# EAGLE design Teensy3Custom (EAGLE 6.5.0)
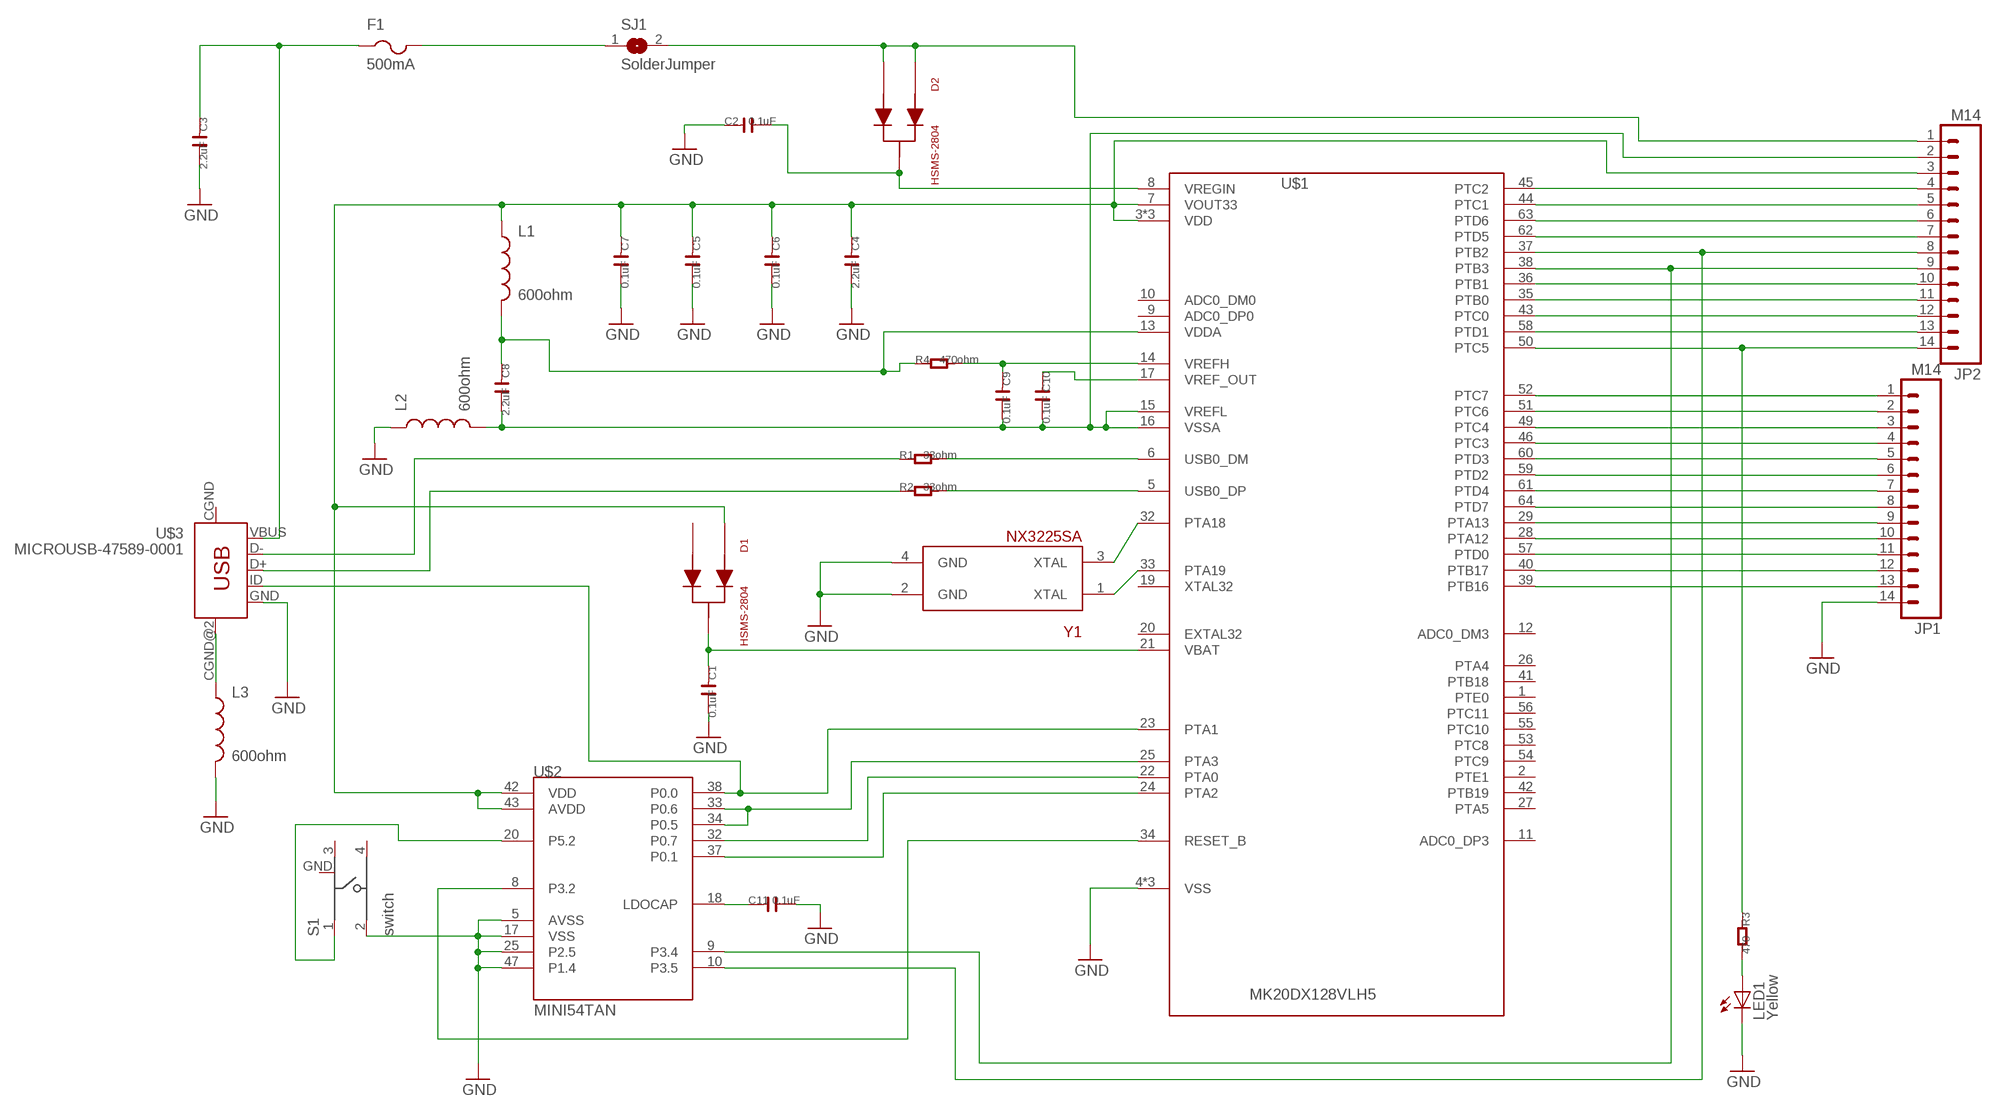
[diagram p0: schematic, sheet 1]

## Parts
C1  0.1uF  C-0603  [C0603]
C2  0.1uF  C-0603  [C0603]
C3  2.2uF  C-0603  [C0603]
C4  2.2uF  C-0603  [C0603]
C5  0.1uF  C-0603  [C0603]
C6  0.1uF  C-0603  [C0603]
C7  0.1uF  C-0603  [C0603]
C8  2.2uF  C-0603  [C0603]
C9  0.1uF  C-0603  [C0603]
C10  0.1uF  C-0603  [C0603]
C11  0.1uF  C-0603  [C0603]
D1  HSMS-2804  [SOT-23-DIODE]
D2  HSMS-2804  [SOT-23-DIODE]
F1  500mA  PTCFUSE-1206  [R1206]
JP1  M14  [1X14]
JP2  M14  [1X14]
L1  600ohm  INDUCTOR0805  [0805]
L2  600ohm  INDUCTOR0805  [0805]
L3  600ohm  INDUCTOR0805  [0805]
LED1  Yellow  LEDCHIP-LED0603  [CHIP-LED0603]
R1  33ohm  R-0603  [R0603]
R2  33ohm  R-0603  [R0603]
R3  470  R-0603  [R0603]
R4  470ohm  R-0603  [R0603]
S1  switch  101-IG  [101-IG]
SJ1  SolderJumper  SJ  [SJ]
U$1  MK20DX128VLH5  [MK20DX128VLH5]
U$2  MINI54TAN  [MINI54TAN]
U$3  MICROUSB-47589-0001  [MICROUSB-47589-0001]
Y1  NX3225SA  [CRYSTAL-SMD-3.2_2.5MM]

## Nets
GND: C1.2 C2.1 C3.2 C4.2 C5.2 C6.2 C7.2 C11.2 JP1.14 L2.1 L3.2 LED1.C S1.2 U$1.4(VSS) U$1.31(VSS) U$1.47(VSS) U$2.5(AVSS) U$2.17(VSS) U$2.25(P2.5) U$2.47(P1.4) U$3.GND Y1.2(GND) Y1.4(GND)
N$1: U$1.32(PTA18) Y1.3(XTAL)
N$2: U$1.33(PTA19) Y1.1(XTAL)
N$3: C1.1 D1.3(OUT) U$1.21(VBAT)
N$4: D2.1(IN) D2.2(IN) JP2.1 SJ1.2
N$5: F1.2 SJ1.1
N$6: C3.1 F1.1 U$3.VBUS
N$7: C2.2 D2.3(OUT) U$1.8(VREGIN)
N$8: C4.1 C5.1 C6.1 C7.1 D1.1(IN) JP2.3 L1.1 U$1.3(VDD) U$1.7(VOUT33) U$1.30(VDD) U$1.48(VDD) U$2.42(VDD) U$2.43(AVDD)
N$9: C8.2 C9.2 C10.2 JP2.2 L2.2 U$1.15(VREFL) U$1.16(VSSA)
N$10: C8.1 L1.2 R4.1 U$1.13(VDDA)
N$11: R2.2 U$1.5(USB0_DP)
N$12: R1.1 U$3.D-
N$13: R1.2 U$1.6(USB0_DM)
N$14: R2.1 U$3.D+
N$15: L3.1 U$3.CGND@2(MTN4)
N$16: U$1.25(PTA3) U$2.33(P0.6) U$2.34(P0.5)
N$17: C10.1 U$1.17(VREF_OUT)
N$18: C9.1 R4.2 U$1.14(VREFH)
N$19: LED1.A R3.2
N$20: JP2.14 R3.1 U$1.50(PTC5)
N$21: S1.1 U$2.20(P5.2)
N$22: U$1.23(PTA1) U$2.38(P0.0) U$3.ID
N$23: U$1.22(PTA0) U$2.32(P0.7)
N$24: U$1.24(PTA2) U$2.37(P0.1)
N$25: JP2.9 U$1.38(PTB3) U$2.9(P3.4)
N$26: JP2.8 U$1.37(PTB2) U$2.10(P3.5)
N$27: U$1.34(RESET_B) U$2.8(P3.2)
N$29: JP2.4 U$1.45(PTC2)
N$30: JP2.5 U$1.44(PTC1)
N$31: JP2.6 U$1.63(PTD6)
N$32: JP2.7 U$1.62(PTD5)
N$33: JP2.10 U$1.36(PTB1)
N$34: JP2.11 U$1.35(PTB0)
N$35: JP2.12 U$1.43(PTC0)
N$36: JP2.13 U$1.58(PTD1)
N$37: JP1.1 U$1.52(PTC7)
N$38: JP1.13 U$1.39(PTB16)
N$39: JP1.12 U$1.40(PTB17)
N$40: JP1.11 U$1.57(PTD0)
N$41: JP1.10 U$1.28(PTA12)
N$42: JP1.9 U$1.29(PTA13)
N$43: JP1.8 U$1.64(PTD7)
N$44: JP1.7 U$1.61(PTD4)
N$45: JP1.6 U$1.59(PTD2)
N$46: JP1.5 U$1.60(PTD3)
N$47: JP1.4 U$1.46(PTC3)
N$48: JP1.3 U$1.49(PTC4)
N$49: JP1.2 U$1.51(PTC6)
N$50: C11.1 U$2.18(LDOCAP)
Unconnected: D1.2(IN) S1.3 S1.4 U$1.1(PTE0) U$1.2(PTE1) U$1.9(ADC0_DP0) U$1.10(ADC0_DM0) U$1.11(ADC0_DP3) U$1.12(ADC0_DM3) U$1.19(XTAL32) U$1.20(EXTAL32) U$1.26(PTA4) U$1.27(PTA5) U$1.41(PTB18) U$1.42(PTB19) U$1.53(PTC8) U$1.54(PTC9) U$1.55(PTC10) U$1.56(PTC11) U$3.CGND(MTN2)

## Power pins joined to a net without a drawn wire
GND: S1.GND

## Library data of the parts
C1-C11 = OPL Eagle Library:C*
D1 D2 = BenLibrary:HSMS-2804: Schottky diode with 3-terminal, common cathode (i.e. two inputs one output). 1A current max. http://www.digikey.com/product-detail/en/HSMS-2804-TR1G/516-1811-2-ND/1235294?WT.z_cid=ref_octopart_dkc_buynow
F1 = adafruit:PTCFUSE: PTC fuses, resettable thermistors
JP1 JP2 = SparkFun-Connectors:M14: Header 14 Standard 14-pin 0.1" header. Use with straight break away headers (SKU : PRT-00116), right angle break away headers (PRT-00553), swiss pins (PRT-00743), machine pins (PRT-00117), and female headers (PRT-00115).
L1-L3 = SparkFun-Passives:INDUCTOR: Inductors Basic Inductor/Choke - 0603 and 1206. Footprints are not proven and vary greatly between part numbers. SRN6045- 33uH, 20% 1.4A SDR0403-560KL - 56uH, 10%, 500mA RMS/740mA peak
LED1 = adafruit:LED: LED OSRAM: - CHIPLED LG R971, LG N971, LY N971, LG Q971, LY Q971, LO R971, LY R971 LH N974, LH R974 LS Q976, LO Q976, LY Q976 LO Q996 - Hyper CHIPLED LW Q18S LB Q993, LB Q99A, LB R99A - SideLED LS A670, LO A670, LY A670, LG A670, LP A670 LB A673, LV A673, LT A673, LW A673 LH A674 LY A675 LS A676, LA A676, LO A676, LY A676, LW A676 LS A679, LY A679, LG A679 - Hyper Micro SIDELED® LS Y876, LA Y876, LO Y876, LY Y876 LT Y87S - SmartLED LW L88C, LW L88S LB L89C, LB L89S, LG L890 LS L89K, LO L89K, LY L89K LS L896, LA L896, LO L896, LY L896 - TOPLED LS T670, LO T670, LY T670, LG T670, LP T670 LSG T670, LSP T670, LSY T670, LOP T670, LYG T670 LG T671, LOG T671, LSG T671 LB T673, LV T673, LT T673, LW T673 LH T674 LS T676, LA T676, LO T676, LY T676, LB T676, LH T676, LSB T676, LW T676 LB T67C, LV T67C, LT T67C, LS T67K, LO T67K, LY T67K, LW E67C LS E67B, LA E67B, LO E67B, LY E67B, LB E67C, LV E67C, LT E67C LW T67C LS T679, LY T679, LG T679 LS T770, LO T770, LY T770, LG T770, LP T770 LB T773, LV T773, LT T773, LW T773 LH T774 LS E675, LA E675, LY E675, LS T675 LS T776, LA T776, LO T776, LY T776, LB T776 LHGB T686 LT T68C, LB T68C - Hyper Mini TOPLED® LB M676 - Mini TOPLED Santana® LG M470 LS M47K, LO M47K, LY M47K Source: http://www.osram.convergy.de/
R1-R4 = OPL Eagle Library:R*
S1 = BLE112 Breakout Board v2.1-non-prefixed:101-IG
SJ1 = BLE112 Breakout Board v2.1-non-prefixed:SJ: SMD solder JUMPER
U$1 = TeensyCustom:MK20DX128VLH5: Teensy 3.0 Processing Unit - MK20DX128VLH5 ARM Cortex M0 Datasheet: http://cache.freescale.com/files/32bit/doc/data_sheet/K20P64M50SF0.pdf
U$2 = TeensyCustom:MINI54TAN: MINI54TAN Bootloader from PJRC.com, preprogrammed with Teensy 3.0 bootloader. https://www.pjrc.com/store/ic_mini54_tqfp.html
U$3 = BLE112 Breakout Board v2.1-non-prefixed:MICROUSB-47589-0001
Y1 = BenLibrary:NX3225SA: 16MHz, 10PF SMD Crystal, NX3225SA http://www.digikey.com/product-detail/en/NX3225SA-16.000000MHZ-T1/644-1100-2-ND

## Board
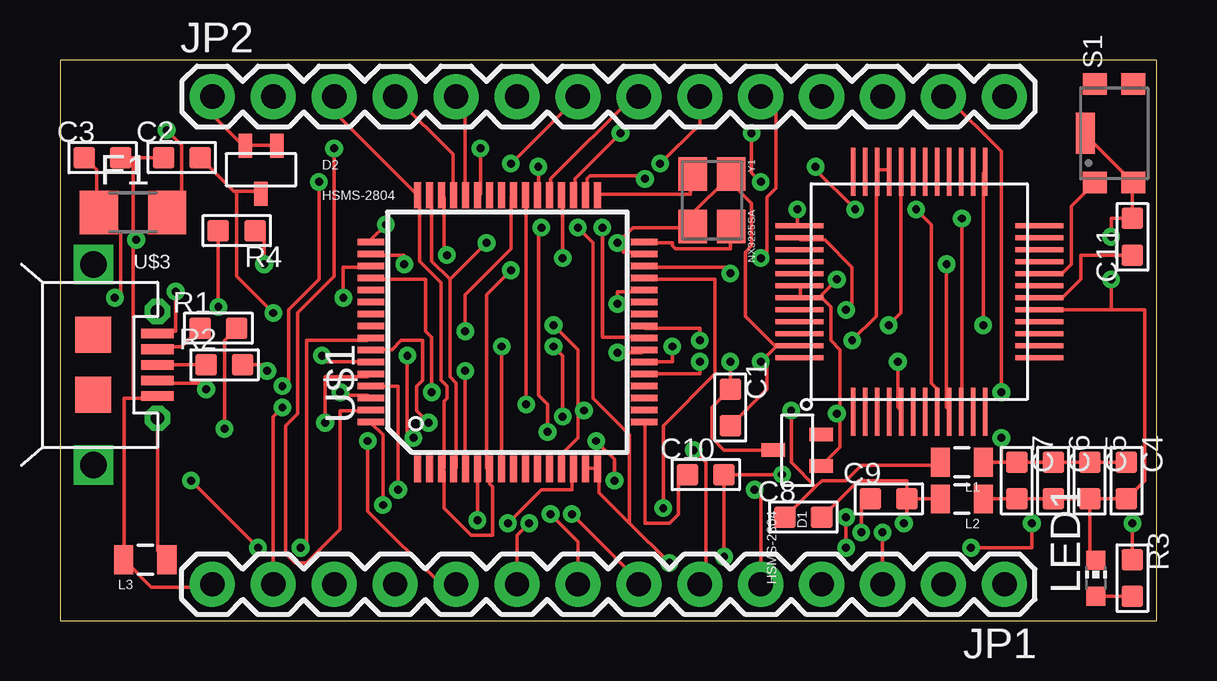
[diagram p1: board, top side]
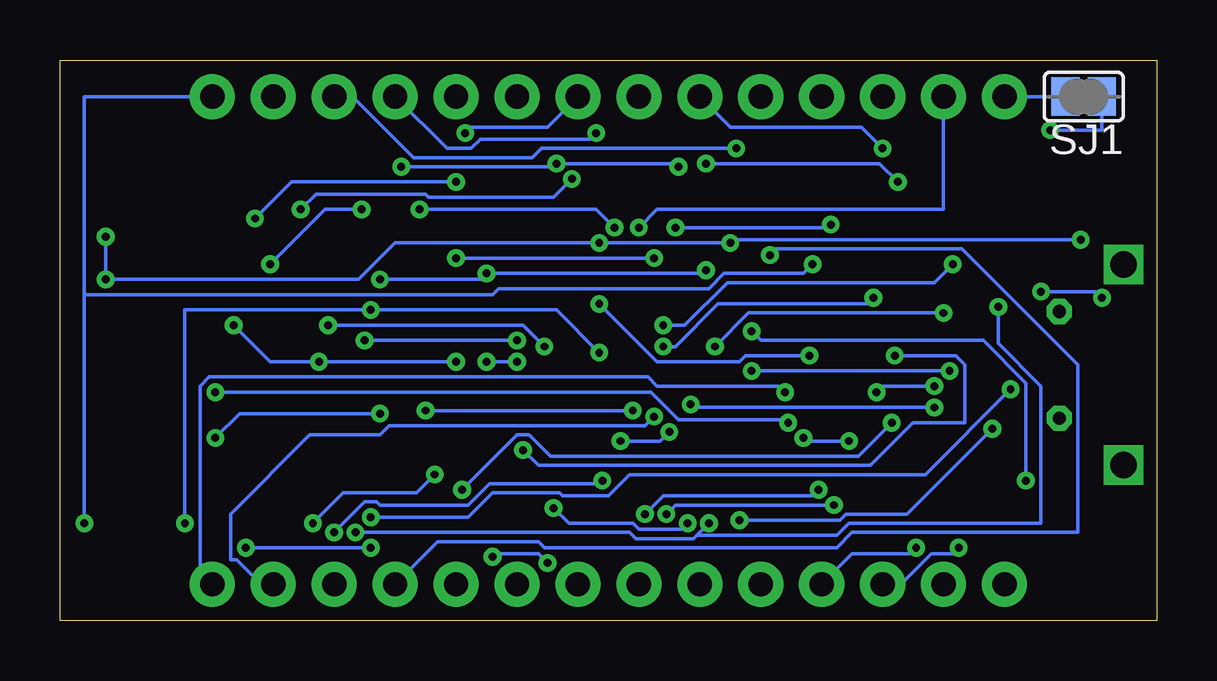
[diagram p2: board, bottom side, seen from below]

Size 45.72 x 23.37 mm. Coordinates in mm from the lower left corner, seen from the top.
Outline: 0,0 45.72,0 45.72,23.37 0,23.37 0,0
Copper layers (1*16): Top 0.035mm / dielectric 1.5mm / Bottom 0.035mm
Design rules "default *": minimum track width 6mil, minimum drill 13mil, track to track 6mil, track to pad 6mil, pad to pad 6mil, via to via 6mil, smd to smd 0mil, copper to edge 15mil, drill to drill 6mil, minimum pad ring 10mil, minimum via ring 8mil, stop-mask expansion 4mil, vias tented up to drill 0mil, thermal gap 10mil

### Footprints (pad centres in the part's own frame; a part is rotated, then mirrored left to right if it is on the bottom)
C0603 = smd 0.889 x 0.889: 1 -0.762,0; 2 0.762,0
SOT-23-DIODE = smd 0.56 x 0.99: 1 0.66,1; 2 -0.66,1; 3 0,-1
R1206 = smd 1.6 x 1.803: 1 -1.422,0; 2 1.422,0
1X14 = drill 1.016 pad 1.88: 1 0,0; 2 2.54,0; 3 5.08,0; 4 7.62,0; 5 10.16,0; 6 12.7,0; 7 15.24,0; 8 17.78,0; 9 20.32,0; 10 22.86,0; 11 25.4,0; 12 27.94,0; 13 30.48,0; 14 33.02,0
0805 = smd 0.8 x 1.2: 1 -0.9,0; 2 0.9,0
CHIP-LED0603 = smd 0.8 x 0.8: A 0,-0.75; C 0,0.75
R0603 = smd 0.889 x 0.889: 1 -0.762,0; 2 0.762,0
101-IG = smd 0.9 x 1: 1 -2.05,0.8; 2 -2.05,-0.8; 3 2.05,0.8; 4 2.05,-0.8 | smd 1.7 x 0.8: GND 0,1.2
SJ = smd 1.168 x 1.6: 1 -0.762,0; 2 0.762,0
MK20DX128VLH5 = smd 1.1 x 0.285: 1 -5.605,3.385; 2 -5.605,2.885; 3 -5.605,2.385; 4 -5.605,1.885; 5 -5.605,1.385; 6 -5.605,0.885; 7 -5.605,0.385; 8 -5.605,-0.115; 9 -5.605,-0.615; 10 -5.605,-1.115; 11 -5.605,-1.615; 12 -5.605,-2.115; 13 -5.605,-2.615; 14 -5.605,-3.115; 15 -5.605,-3.615; 16 -5.605,-4.115; 33 5.795,-4.115; 34 5.795,-3.615; 35 5.795,-3.115; 36 5.795,-2.615; 37 5.795,-2.115; 38 5.795,-1.615; 39 5.795,-1.115; 40 5.795,-0.615; 41 5.795,-0.115; 42 5.795,0.385; 43 5.795,0.885; 44 5.795,1.385; 45 5.795,1.885; 46 5.795,2.385; 47 5.795,2.885; 48 5.795,3.385 | smd 0.285 x 1.1: 17 -3.655,-6.065; 18 -3.155,-6.065; 19 -2.655,-6.065; 20 -2.155,-6.065; 21 -1.655,-6.065; 22 -1.155,-6.065; 23 -0.655,-6.065; 24 -0.155,-6.065; 25 0.345,-6.065; 26 0.845,-6.065; 27 1.345,-6.065; 28 1.845,-6.065; 29 2.345,-6.065; 30 2.845,-6.065; 31 3.345,-6.065; 32 3.845,-6.065; 49 3.845,5.335; 50 3.345,5.335; 51 2.845,5.335; 52 2.345,5.335; 53 1.845,5.335; 54 1.345,5.335; 55 0.845,5.335; 56 0.345,5.335; 57 -0.155,5.335; 58 -0.655,5.335; 59 -1.155,5.335; 60 -1.655,5.335; 61 -2.155,5.335; 62 -2.655,5.335; 63 -3.155,5.335; 64 -3.655,5.335
MINI54TAN = smd 0.2 x 2: 1 -2.75,-5; 2 -2.25,-5; 3 -1.75,-5; 4 -1.25,-5; 5 -0.75,-5; 6 -0.25,-5; 7 0.25,-5; 8 0.75,-5; 9 1.25,-5; 10 1.75,-5; 11 2.25,-5; 12 2.75,-5; 25 2.75,5; 26 2.25,5; 27 1.75,5; 28 1.25,5; 29 0.75,5; 30 0.25,5; 31 -0.25,5; 32 -0.75,5; 33 -1.25,5; 34 -1.75,5; 35 -2.25,5; 36 -2.75,5 | smd 2 x 0.2: 13 5,-2.75; 14 5,-2.25; 15 5,-1.75; 16 5,-1.25; 17 5,-0.75; 18 5,-0.25; 19 5,0.25; 20 5,0.75; 21 5,1.25; 22 5,1.75; 23 5,2.25; 24 5,2.75; 37 -5,2.75; 38 -5,2.25; 39 -5,1.75; 40 -5,1.25; 41 -5,0.75; 42 -5,0.25; 43 -5,-0.25; 44 -5,-0.75; 45 -5,-1.25; 46 -5,-1.75; 47 -5,-2.25; 48 -5,-2.75
MICROUSB-47589-0001 = drill 0.55 pad 1 octagon: CGND 0,2.225; CGND@2 0,-2.225 | drill 1.1 pad 1.6 square: CGND@3 -2.675,-4.175; CGND@4 -2.675,4.175 | smd 1.5 x 1.5: CGND@5 -2.675,1.25; CGND@6 -2.675,-1.25 | smd 1.35 x 0.4: D+ 0,0; D- 0,0.65; GND 0,-1.3; ID 0,-0.65; VBUS 0,1.3
CRYSTAL-SMD-3.2_2.5MM = smd 1.4 x 1.2: 1 -1.1,-0.8; 2 1.1,-0.8; 3 1.1,0.8; 4 -1.1,0.8

### Placement (x,y rotation side)
C1  27.94,8.89 270 top
C2  5.08,19.3 0 top
C3  1.78,19.3 0 top
C4  44.45,5.84 270 top
C5  42.93,5.84 270 top
C6  41.4,5.84 270 top
C7  39.88,5.84 270 top
C8  30.99,4.32 0 top
C9  34.54,5.08 0 top
C10  26.92,6.1 0 top
C11  44.7,16 90 top
D1  30.73,7.11 270 top
D2  8.38,18.8 0 top
F1  3.05,17.02 0 top
JP1  39.37,1.52 180 top
JP2  6.35,21.84 0 top
L1  37.59,6.6 180 top
L2  37.59,5.08 180 top
L3  3.56,2.54 180 top
LED1  43.18,1.78 0 top
R1  6.6,12.19 0 top
R2  6.86,10.67 0 top
R3  44.7,1.78 270 top
R4  7.37,16.26 180 top
S1  43.94,20.32 90 top
SJ1  3.05,21.84 180 bottom
U$1  18.29,11.94 90 top
U$2  35.81,13.72 0 top
U$3  4.06,10.67 0 top
Y1  27.18,17.53 270 top

### Tracks (layer width: path | path; a pad name or v marks a point on that pad's centre or on a via)
GND  (via drill 0.33)
  Top 0.152: C2.1 3.05,19.3 | 3.05,19.3 C3.2 | L3.2 3.81,1.4 6.35,1.4 JP1.14 | 3.05,9.27 2.67,9.27 L3.2 | 3.05,9.27 4.06,9.27 U$3.GND | L3.2 | 3.05,9.27 3.05,15.88 | 3.05,15.88 3.05,19.3 | S1.GND 42.8,20.32 42.8,20.19 44.7,18.29 S1.2 44.7,18.16 C11.2 43.81,16.76 v43.81,16 | L2.1 C7.2 C6.2 C5.2 | C5.2 42.93,2.79 LED1.C | C5.2 C4.2 45.21,5.84 45.21,12.95 43.81,12.95 | 43.81,12.95 40.89,12.95 U$2.17 | 43.81,12.95 v43.81,14.22 | 16.26,14.22 15.49,14.99 15.49,17.65 U$1.47 | 16.26,14.22 16.26,10.16 16.51,9.91 16.51,6.35 U$1.4 | 23.5,15.75 23.5,16 23.88,16.38 26.29,16.38 Y1.2 26.42,16.51 26.42,17.02 27.81,18.41 | 23.5,15.75 23.5,15.37 24.26,15.37 U$1.31 | 27.81,18.41 27.94,18.54 Y1.4 27.81,18.41 | C1.2 29.46,9.65 29.46,10.79 | 29.46,10.79 29.46,11.05 29.84,11.43 | 29.84,11.43 30.73,11.43 U$2.47 29.84,11.43 | v34.92,10.79 34.92,8.89 35.05,8.76 U$2.5 | 29.46,10.79 v29.21,10.79 | v38.48,12.32 38.48,18.67 U$2.25 | 27.81,18.41 28.83,17.4 28.83,15.62 28.57,15.37 28.57,12.7 29.84,11.43 | v17.78,15.75 16.26,14.22 | 23.5,15.75 v23.24,15.75 | v3.17,15.88 3.05,15.88
  Bottom 0.152: v43.81,16 v43.81,14.22 33.27,14.22 31.75,15.75 v23.24,15.75 v17.78,15.75 17.65,15.88 v3.17,15.88 | v29.21,10.79 v34.92,10.79 36.96,10.79 v38.48,12.32
N$1
  Top 0.152: U$1.32 24.38,15.75 25.53,15.75 25.53,15.62 25.65,15.49 27.94,15.49 27.94,16.38 Y1.3
N$2
  Top 0.152: U$1.33 22.48,17.78 26.29,17.78 26.29,18.54 Y1.1
N$3  (via drill 0.33)
  Top 0.152: D1.3 27.69,7.11 27.18,7.62 27.18,8.89 C1.1 v27.94,10.79 | v26.67,10.79 26.67,10.29 24.38,10.29 U$1.21
  Bottom 0.152: v27.94,10.79 v26.67,10.79
N$4
  Top 0.152: D2.1 9.02,19.81 7.75,19.81 D2.2 7.62,19.81 6.35,21.08 JP2.1
  Bottom 0.152: JP2.1 SJ1.2
N$5  (via drill 0.33)
  Top 0.152: v4.45,20.45 5.08,19.81 5.08,17.53 4.57,17.02 F1.2
  Bottom 0.152: SJ1.1 2.29,20.45 v4.45,20.45
N$6  (via drill 0.33)
  Top 0.152: C3.1 1.52,18.8 1.52,17.02 F1.1 1.65,17.02 2.54,16.13 2.54,13.72 v2.29,13.46 | v4.83,13.72 4.83,12.06 4.06,12.06 U$3.VBUS
  Bottom 0.152: v4.83,13.72 2.54,13.72 v2.29,13.46
N$7  (via drill 0.33)
  Top 0.152: C2.2 7.24,17.91 7.37,17.91 | 7.37,17.91 8.38,17.91 D2.3 | v18.41,11.43 18.41,6.35 U$1.8 | v8.89,12.83 7.37,14.35 7.37,17.91
  Bottom 0.152: v18.41,11.43 17.02,12.83 v8.89,12.83
N$8  (via drill 0.33)
  Top 0.152: JP2.3 11.43,21.21 14.86,17.78 U$1.48 14.99,17.65 14.99,14.99 15.88,14.1 15.88,10.03 16.13,9.78 16.13,9.27 16,9.14 16,6.35 U$1.3 16,6.22 16,4.7 17.14,3.56 18.03,3.56 18.03,5.59 17.91,5.71 17.91,6.22 U$1.7 17.78,6.35 17.78,13.59 v18.8,14.61 | L1.1 39.24,6.6 | 39.24,6.6 C7.1 C6.1 C5.1 C4.1 | 32.51,8.64 32.51,11.3 32.13,11.68 32.13,13.08 31.75,13.46 | 32.51,8.64 32.51,7.24 31.75,6.48 D1.1 | 30.86,13.46 31.75,13.46 | v27.94,14.48 27.94,14.73 24.38,14.73 U$1.30 | v32.38,14.22 31.75,13.59 31.75,13.46 | 31.75,13.46 U$2.43 30.86,13.46 | 30.86,13.46 30.86,13.97 U$2.42 | v39.24,7.62 39.24,6.6 | 32.51,8.64 v32.38,8.64
  Bottom 0.152: v32.38,14.22 28.19,14.22 v27.94,14.48 18.92,14.48 v18.8,14.61 | v39.24,7.62 38.23,8.64 v32.38,8.64
N$9  (via drill 0.33)
  Top 0.152: U$1.15 21.97,6.35 22.35,6.35 U$1.16 22.48,6.22 22.48,5.33 23.75,4.06 | C8.2 33.27,5.84 35.31,5.84 C9.2 | v30.1,6.1 C10.2 v27.69,2.67 | v35.18,4.06 35.31,4.19 C9.2 | C9.2 L2.2 | v25.4,2.41 23.75,4.06 | v21.59,16.38 22.23,15.75 22.23,9.27 23.75,7.75 23.75,4.06
  Bottom 0.152: v30.1,6.1 30.86,5.33 33.91,5.33 v35.18,4.06 | v25.4,2.41 25.78,2.79 27.56,2.79 v27.69,2.67 | JP2.2 8.89,17.14 20.83,17.14 v21.59,16.38
N$10  (via drill 0.33)
  Top 0.152: 31.5,5.59 31.75,5.84 32.77,5.84 33.4,6.48 36.58,6.48 36.58,6.6 L1.2 | 31.5,5.59 C8.1 | R4.1 8.51,15.88 v8.51,14.86 | v20.57,12.32 21.59,11.3 21.59,8.76 | 21.59,8.76 21.59,7.62 20.95,6.99 20.95,6.35 U$1.13 | 31.5,5.59 30.48,6.6 v30.48,8.76 | 21.59,8.76 v21.84,8.76
  Bottom 0.152: v8.51,14.86 9.27,14.1 17.91,14.1 19.68,12.32 v20.57,12.32 | v21.84,8.76 v30.48,8.76
N$11  (via drill 0.33)
  Top 0.152: R2.2 8.64,10.67 v8.64,10.41 | v16.89,10.41 16.89,6.35 U$1.5
  Bottom 0.152: v16.89,10.41 v8.64,10.41
N$12
  Top 0.152: R1.1 5.08,11.43 4.06,11.43 U$3.D-
N$13  (via drill 0.33)
  Top 0.152: R1.2 6.86,11.68 v6.86,8 | v17.4,4.19 17.4,6.22 U$1.6
  Bottom 0.152: v6.86,8 10.41,4.45 12.95,4.45 13.21,4.19 v17.4,4.19
N$14
  Top 0.152: U$3.D+ R2.1
N$15
  Top 0.152: U$3.CGND@2 4.06,2.92 4.45,2.54 L3.1
N$16  (via drill 0.33)
  Top 0.152: v26.67,11.68 26.67,12.19 24.38,12.19 U$1.25 | v33.02,11.68 34.04,12.7 34.04,18.67 U$2.34 34.16,18.8 34.54,18.8 U$2.33
  Bottom 0.152: v33.02,11.68 v26.67,11.68
N$17
  Top 0.152: C10.1 25.78,5.71 25.78,4.45 25.4,4.06 24.38,4.06 24.38,8.26 U$1.17
N$18  (via drill 0.33)
  Top 0.152: C9.1 33.4,4.7 v33.4,3.68 | v18.67,4.06 20.07,5.46 21.34,5.46 21.34,6.22 U$1.14 | v6.6,13.08 R4.2
  Bottom 0.152: v33.4,3.68 21.97,3.68 21.72,3.43 19.3,3.43 19.18,3.56 | v18.67,4.06 19.18,3.56 | v6.6,13.08 6.6,11.56 4.83,9.78 4.83,4.06 12.83,4.06 13.34,3.56 19.18,3.56
N$19
  Top 0.152: R3.2 43.18,1.02 LED1.A
N$20  (via drill 0.33)
  Top 0.152: v44.7,4.06 R3.1 | v14.35,14.86 14.35,15.24 12.95,15.24 U$1.50
  Bottom 0.152: 44.7,13.59 44.7,21.84 JP2.14 | 44.7,13.59 v44.7,4.06 | v14.35,14.86 14.73,14.48 18.03,14.48 18.67,13.84 27.43,13.84 27.69,13.59 44.7,13.59
N$21
  Top 0.152: S1.1 43.05,18.16 42.16,17.27 42.16,14.86 41.78,14.48 40.89,14.48 U$2.20
N$22  (via drill 0.33)
  Top 0.152: v23.24,11.18 24.26,11.18 U$1.23 | v32.77,12.95 33.02,13.21 33.02,14.73 31.88,15.88 30.86,15.88 U$2.38 | v6.1,9.65 6.1,9.91 4.06,9.91 U$3.ID | v32.77,3.05 v32.77,4.32 | v37.97,3.05 40.51,3.05 v40.51,4.06
  Bottom 0.152: v23.24,11.18 25.02,12.95 v32.77,12.95 40.51,12.95 v40.51,4.06 | v6.1,9.65 9.65,6.1 21.97,6.1 22.86,5.21 24.77,5.21 24.89,5.33 27.69,5.33 28.7,4.32 v32.77,4.32 | v37.97,3.05 v32.77,3.05
N$23  (via drill 0.33)
  Top 0.152: v25.53,11.43 25.53,10.79 24.38,10.79 U$1.22 | v34.54,12.32 35.05,12.83 35.05,18.67 U$2.32
  Bottom 0.152: v25.53,11.43 26.42,12.32 v34.54,12.32
N$24  (via drill 0.33)
  Top 0.152: v22.61,16.38 22.61,11.81 24.26,11.81 U$1.24 | v30.73,17.14 30.73,16.51 U$2.37
  Bottom 0.152: v22.61,16.38 23.37,17.14 v30.73,17.14
N$25  (via drill 0.33)
  Top 0.152: v19.94,18.92 19.94,17.78 U$1.38 | v25.02,19.05 26.67,20.7 JP2.9 | v36.96,14.86 36.96,8.89 37.08,8.76 U$2.9 | v33.15,17.14 31.5,18.8 v31.5,18.92
  Bottom 0.152: v19.94,18.92 20.07,19.05 v25.02,19.05 25.15,18.92 v31.5,18.92 | v36.96,14.86 34.67,17.14 v33.15,17.14
N$26  (via drill 0.33)
  Top 0.152: JP2.8 23.88,21.84 20.45,18.41 20.45,17.78 U$1.37 | v37.59,16.76 37.59,8.76 U$2.10 | v29.21,18.29 28.83,18.67 v28.83,20.32
  Bottom 0.152: v37.59,16.76 36.07,18.29 v29.21,18.29 | v28.83,20.32 28.57,20.57 25.4,20.57 JP2.8
N$27  (via drill 0.33)
  Top 0.152: v24.38,18.41 24.38,18.54 22.1,18.54 21.97,18.41 21.97,17.78 U$1.34 | v35.69,17.14 36.32,16.51 36.32,9.91 36.58,9.65 36.58,8.76 U$2.8
  Bottom 0.152: v24.38,18.41 25.15,17.65 30.35,17.65 30.48,17.78 35.05,17.78 v35.69,17.14
N$29
  Top 0.152: JP2.4 16.38,19.43 16.38,17.78 U$1.45
N$30
  Top 0.152: JP2.5 16.89,21.46 16.89,17.78 U$1.44
N$31  (via drill 0.33)
  Top 0.152: v11.43,19.68 11.43,14.35 9.91,12.83 9.91,8.64 9.4,8.13 9.4,2.79 9.78,2.41 10.29,2.41 11.68,3.81 11.68,8.76 12.83,8.76 U$1.63
  Bottom 0.152: v11.43,19.68 12.32,20.57 17.78,20.57 JP2.6
N$32  (via drill 0.33)
  Top 0.152: v11.68,9.53 11.68,9.4 12.83,9.4 U$1.62 | v9.27,9.78 9.53,10.03 9.53,12.95 10.79,14.22 v10.79,18.29 | JP2.7 v18.8,19.05
  Bottom 0.152: v11.68,9.53 11.43,9.78 v9.27,9.78 | v10.79,18.29 11.56,19.05 v18.8,19.05
N$33  (via drill 0.33)
  Top 0.152: v20.95,15.11 20.95,17.65 U$1.36 | v29.21,15.11 29.46,15.37 29.46,17.65 29.84,18.03 29.84,21.21 JP2.10
  Bottom 0.152: v29.21,15.11 v20.95,15.11
N$34  (via drill 0.33)
  Top 0.152: v23.37,20.32 21.46,18.41 21.46,17.78 U$1.35
  Bottom 0.152: v23.37,20.32 23.62,20.07 28.19,20.07 28.57,19.68 29.59,19.68 JP2.11
N$35  (via drill 0.33)
  Top 0.152: v17.53,19.68 17.53,17.78 U$1.43
  Bottom 0.152: v17.53,19.68 25.65,19.68 26.04,19.3 30.99,19.3 33.53,21.84 JP2.12
N$36  (via drill 0.33)
  Top 0.152: v15.37,8.26 14.86,8.76 14.86,9.78 15.11,10.03 15.11,11.68 14.22,11.68 13.84,11.3 12.95,11.3 U$1.58 | v39.24,9.53 39.24,19.56 36.96,21.84 JP2.13
  Bottom 0.152: v15.37,8.26 15.49,8.38 19.94,8.38 21.08,9.53 v39.24,9.53
N$37  (via drill 0.33)
  Top 0.152: v15.49,9.53 15.49,11.81 15.24,12.06 15.24,14.22 12.95,14.22 U$1.52
  Bottom 0.152: v15.49,9.53 15.75,9.78 20.83,9.78 21.21,10.16 39.5,10.16 39.88,9.78 39.88,1.52 JP1.1
N$38  (via drill 0.33)
  Top 0.152: v19.43,9.02 19.43,17.65 U$1.39 | v9.27,8.89 8.89,8.51 JP1.13
  Bottom 0.152: v19.43,9.02 19.3,8.89 v9.27,8.89
N$39  (via drill 0.33)
  Top 0.152: v16.89,12.06 16.89,13.59 18.8,15.49 18.8,17.65 U$1.40 | v8.26,3.05 v5.46,5.84
  Bottom 0.152: v16.89,12.06 16.51,11.68 7.24,11.68 5.46,9.91 v5.46,5.84 | v8.26,3.05 8.51,2.79 9.4,2.79 10.67,1.52 JP1.12
N$40  (via drill 0.33)
  Top 0.152: v10.03,3.05 10.29,3.3 10.29,11.68 12.83,11.68 U$1.57
  Bottom 0.152: v10.03,3.05 10.29,2.79 12.7,2.79 JP1.11
N$41  (via drill 0.33)
  Top 0.152: v23.24,13.21 23.24,13.72 24.26,13.72 U$1.28 | v14.48,11.05 14.48,7.87 v14.73,7.62 | v12.83,7.49 12.83,4.57 15.88,1.52 JP1.10
  Bottom 0.152: v23.24,13.21 20.83,10.79 17.4,10.79 17.14,11.05 v14.48,11.05 | v14.73,7.62 14.61,7.49 v12.83,7.49
N$42  (via drill 0.33)
  Top 0.152: v25.15,4.7 25.15,8.13 27.3,10.29 27.3,14.22 24.38,14.22 U$1.29 | v19.56,4.06 19.05,3.56 JP1.9
  Bottom 0.152: v25.15,4.7 24.51,4.06 21.84,4.06 21.59,3.81 19.81,3.81 v19.56,4.06
N$43  (via drill 0.33)
  Top 0.152: v13.46,4.83 13.46,7.75 12.95,8.26 U$1.64 | v20.45,4.45 21.59,3.3 JP1.8
  Bottom 0.152: v13.46,4.83 20.07,4.83 v20.45,4.45
N$44  (via drill 0.33)
  Top 0.152: v14.1,5.46 14.1,9.78 U$1.61 | v21.34,4.45 24.13,1.65 JP1.7
  Bottom 0.152: v14.1,5.46 14.35,5.21 20.57,5.21 v21.34,4.45
N$45  (via drill 0.33)
  Top 0.152: v10.92,11.05 10.92,10.79 12.83,10.79 U$1.59 | v26.42,7.11 26.92,6.6 26.92,1.78 JP1.6
  Bottom 0.152: v10.92,11.05 8.38,11.05 8,10.67 8,8.26 10.16,8.26 11.94,6.48 25.78,6.48 v26.42,7.11
N$46  (via drill 0.33)
  Top 0.152: v11.05,8.26 11.05,10.16 12.83,10.16 U$1.60 | v28.96,5.46 29.21,5.21 JP1.5
  Bottom 0.152: v11.05,8.26 12.45,6.86 25.27,6.86 26.16,7.75 26.67,7.75 v28.96,5.46
N$47  (via drill 0.33)
  Top 0.152: v16.13,15.24 16,15.37 16,17.65 U$1.46
  Bottom 0.152: v16.13,15.24 15.88,15.49 8.13,15.49 3.3,10.67 3.3,3.68 12.7,3.68 13.34,3.05 25.53,3.05 25.78,3.3 29.97,3.3 JP1.4
N$48  (via drill 0.33)
  Top 0.152: v13.59,16.51 12.95,15.88 U$1.49 | v20.07,16.38 19.94,16.26 19.94,9.4 20.32,9.02 v20.32,7.87 | v22.35,7.49 23.11,6.73 v23.11,5.84 | JP1.3 v34.29,3.68
  Bottom 0.152: v13.59,16.51 13.72,16.38 v20.07,16.38 | v20.32,7.87 20.7,7.49 v22.35,7.49 | v23.11,5.84 23.24,5.71 27.81,5.71 28.7,4.83 32.38,4.83 32.51,4.95 33.02,4.95 v34.29,3.68
N$49  (via drill 0.33)
  Top 0.152: v11.81,13.46 11.81,14.73 12.83,14.73 U$1.51 | v20.57,11.43 20.95,11.05 v20.95,8.51
  Bottom 0.152: v11.81,13.46 12.06,13.21 18.29,13.21 20.07,11.43 v20.57,11.43 | v20.95,8.51 21.34,8.13 32,8.13 32.38,7.75 35.31,7.75 38.61,4.45 38.61,2.54 38.35,2.54 37.34,1.52 JP1.2
N$50
  Top 0.152: C11.1 42.55,15.24 42.55,14.22 41.78,13.46 40.89,13.46 U$2.18